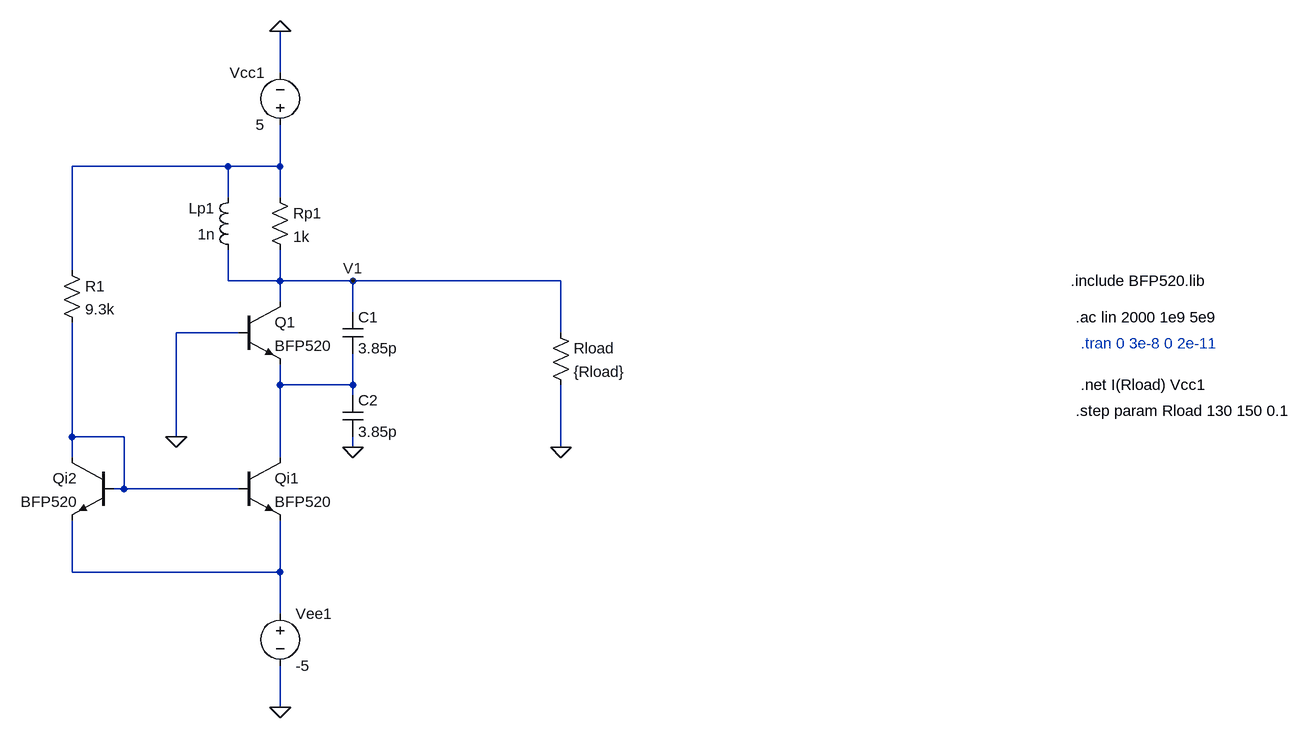
[diagram p0: schematic Ouput-Port-Impedance.asc]
Ouput-Port-Impedance.asc, the LTspice schematic file:
Version 4
SHEET 1 1356 1008
WIRE -368 16 -368 -48
WIRE -448 160 -688 160
WIRE -368 160 -368 96
WIRE -368 160 -448 160
WIRE -448 208 -448 160
WIRE -368 208 -368 160
WIRE -688 320 -688 160
WIRE -448 336 -448 288
WIRE -368 336 -368 288
WIRE -368 336 -448 336
WIRE -256 336 -368 336
WIRE 64 336 -256 336
WIRE -368 368 -368 336
WIRE -256 384 -256 336
WIRE -432 416 -528 416
WIRE 64 416 64 336
WIRE -368 496 -368 464
WIRE -256 496 -256 448
WIRE -256 496 -368 496
WIRE -256 512 -256 496
WIRE -688 576 -688 400
WIRE -608 576 -688 576
WIRE -528 576 -528 416
WIRE -256 592 -256 576
WIRE 64 592 64 496
WIRE -688 608 -688 576
WIRE -368 608 -368 496
WIRE -608 656 -608 576
WIRE -608 656 -624 656
WIRE -432 656 -608 656
WIRE -688 784 -688 704
WIRE -368 784 -368 704
WIRE -368 784 -688 784
WIRE -368 848 -368 784
WIRE -368 992 -368 928
FLAG -368 -48 0
FLAG -368 992 0
FLAG -528 576 0
FLAG -256 592 0
FLAG -256 336 V1
FLAG 64 592 0
SYMBOL npn -432 368 R0
SYMATTR InstName Q1
SYMATTR Value BFP520
SYMBOL ind -432 304 R180
WINDOW 0 36 80 Left 2
WINDOW 3 36 40 Left 2
SYMATTR InstName Lp1
SYMATTR Value 1n
SYMBOL Res -384 192 R0
SYMATTR InstName Rp1
SYMATTR Value 1k
SYMBOL Voltage -368 112 R180
WINDOW 0 24 96 Left 2
WINDOW 3 24 16 Left 2
SYMATTR InstName Vcc1
SYMATTR Value 5
SYMBOL npn -432 608 R0
SYMATTR InstName Qi1
SYMATTR Value BFP520
SYMBOL npn -624 608 M0
SYMATTR InstName Qi2
SYMATTR Value BFP520
SYMBOL Res -704 304 R0
SYMATTR InstName R1
SYMATTR Value 9.3k
SYMBOL Voltage -368 832 R0
SYMATTR InstName Vee1
SYMATTR Value -5
SYMBOL cap -272 384 R0
SYMATTR InstName C1
SYMATTR Value 3.85p
SYMBOL cap -272 512 R0
SYMATTR InstName C2
SYMATTR Value 3.85p
SYMBOL Res 48 400 R0
SYMATTR InstName Rload
SYMATTR Value {Rload}
TEXT 848 336 Left 2 !.include BFP520.lib
TEXT 856 392 Left 2 !.ac lin 2000 1e9 5e9
TEXT 864 432 Left 2 ;.tran 0 3e-8 0 2e-11
TEXT 864 496 Left 2 !.net I(Rload) Vcc1
TEXT 856 536 Left 2 !.step param Rload 130 150 0.1

The netlist it stands for:
* Ouput-Port-Impedance.asc
Q1 V1 0 N002 0 BFP520
Lp1 V1 N001 1n
Rp1 N001 V1 1k
Vcc1 N001 0 5
Qi1 N002 N003 N004 0 BFP520
Qi2 N003 N003 N004 0 BFP520
R1 N001 N003 9.3k
Vee1 N004 0 -5
C1 V1 N002 3.85p
C2 N002 0 3.85p
Rload V1 0 {Rload}
.model NPN NPN
.model PNP PNP
.lib standard.bjt
.include BFP520.lib
.ac lin 2000 1e9 5e9
* .tran 0 3e-8 0 2e-11
.net I(Rload) Vcc1
.step param Rload 130 150 0.1
.backanno
.end